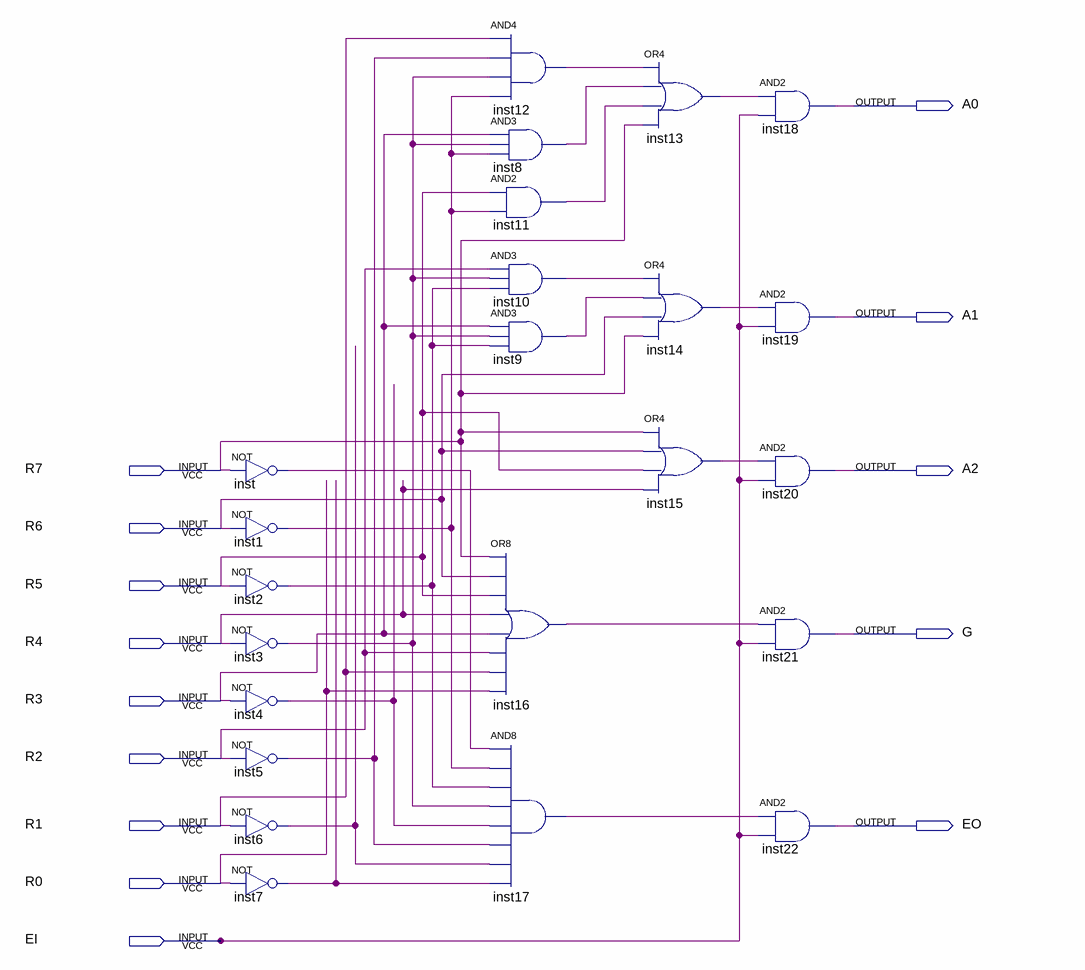
[diagram p0: schematic sheet]
// Quartus schematic enc_8_3_sch.bdf as structural Verilog: 23 symbols, 14 pins
module enc_8_3_sch (
  input  R7,
  input  R6,
  input  R5,
  input  R4,
  input  R3,
  input  R2,
  input  R1,
  input  R0,
  input  EI,
  output A0,
  output A1,
  output A2,
  output G,
  output EO
);

  wire inst1_out, inst2_out, inst3_out, inst4_out, inst5_out, inst6_out, inst7_out, inst8_out, inst9_out,
       inst10_out, inst11_out, inst12_out, inst13_out, inst14_out, inst15_out, inst16_out, inst17_out,
       inst_out;

  not inst (inst_out, R7);
  not inst1 (inst1_out, R6);
  not inst2 (inst2_out, R5);
  not inst3 (inst3_out, R4);
  not inst4 (inst4_out, R3);
  not inst5 (inst5_out, R2);
  not inst6 (inst6_out, R1);
  not inst7 (inst7_out, R0);
  and inst12 (inst12_out, R1, inst5_out, inst3_out, inst1_out);
  and inst8 (inst8_out, R3, inst3_out, inst1_out);
  and inst11 (inst11_out, R5, inst1_out);
  and inst10 (inst10_out, R2, inst3_out, inst2_out);
  and inst9 (inst9_out, R3, inst3_out, inst2_out);
  or inst16 (inst16_out, R7, R6, R5, R4, R3, R2, R1, R0);
  and inst17 (inst17_out, inst_out, inst1_out, inst2_out, inst3_out, inst4_out, inst5_out, inst6_out, inst7_out);
  or inst13 (inst13_out, inst12_out, inst8_out, inst11_out, R7);
  or inst14 (inst14_out, inst10_out, inst9_out, R6, R7);
  or inst15 (inst15_out, R7, R6, R5, R4);
  and inst18 (A0, inst13_out, EI);
  and inst19 (A1, inst14_out, EI);
  and inst20 (A2, inst15_out, EI);
  and inst21 (G, inst16_out, EI);
  and inst22 (EO, inst17_out, EI);
endmodule
